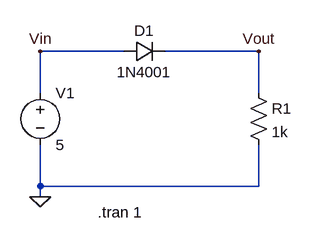
[diagram p0: schematic 311_lab2_p1.asc]
311_lab2_p1.asc, the LTspice schematic file:
Version 4
SHEET 1 880 680
WIRE 176 64 48 64
WIRE 384 64 240 64
WIRE 48 128 48 64
WIRE 384 128 384 64
WIRE 48 272 48 208
WIRE 384 272 384 208
WIRE 384 272 48 272
WIRE 48 288 48 272
FLAG 48 288 0
FLAG 48 64 Vin
FLAG 384 64 Vout
SYMBOL voltage 48 112 R0
WINDOW 123 0 0 Left 0
WINDOW 39 0 0 Left 0
SYMATTR InstName V1
SYMATTR Value 5
SYMBOL diode 176 80 R270
WINDOW 0 32 32 VTop 2
WINDOW 3 0 32 VBottom 2
SYMATTR InstName D1
SYMATTR Value 1N4001
SYMBOL res 368 112 R0
SYMATTR InstName R1
SYMATTR Value 1k
TEXT 136 312 Left 2 !.tran 1

The netlist it stands for:
* 311_lab2_p1.asc
V1 Vin 0 5
D1 Vin Vout 1N4001
R1 Vout 0 1k
.model D D
.lib standard.dio
.tran 1
.backanno
.end